# Altium project Cell Characterization Board V2.PrjPcb
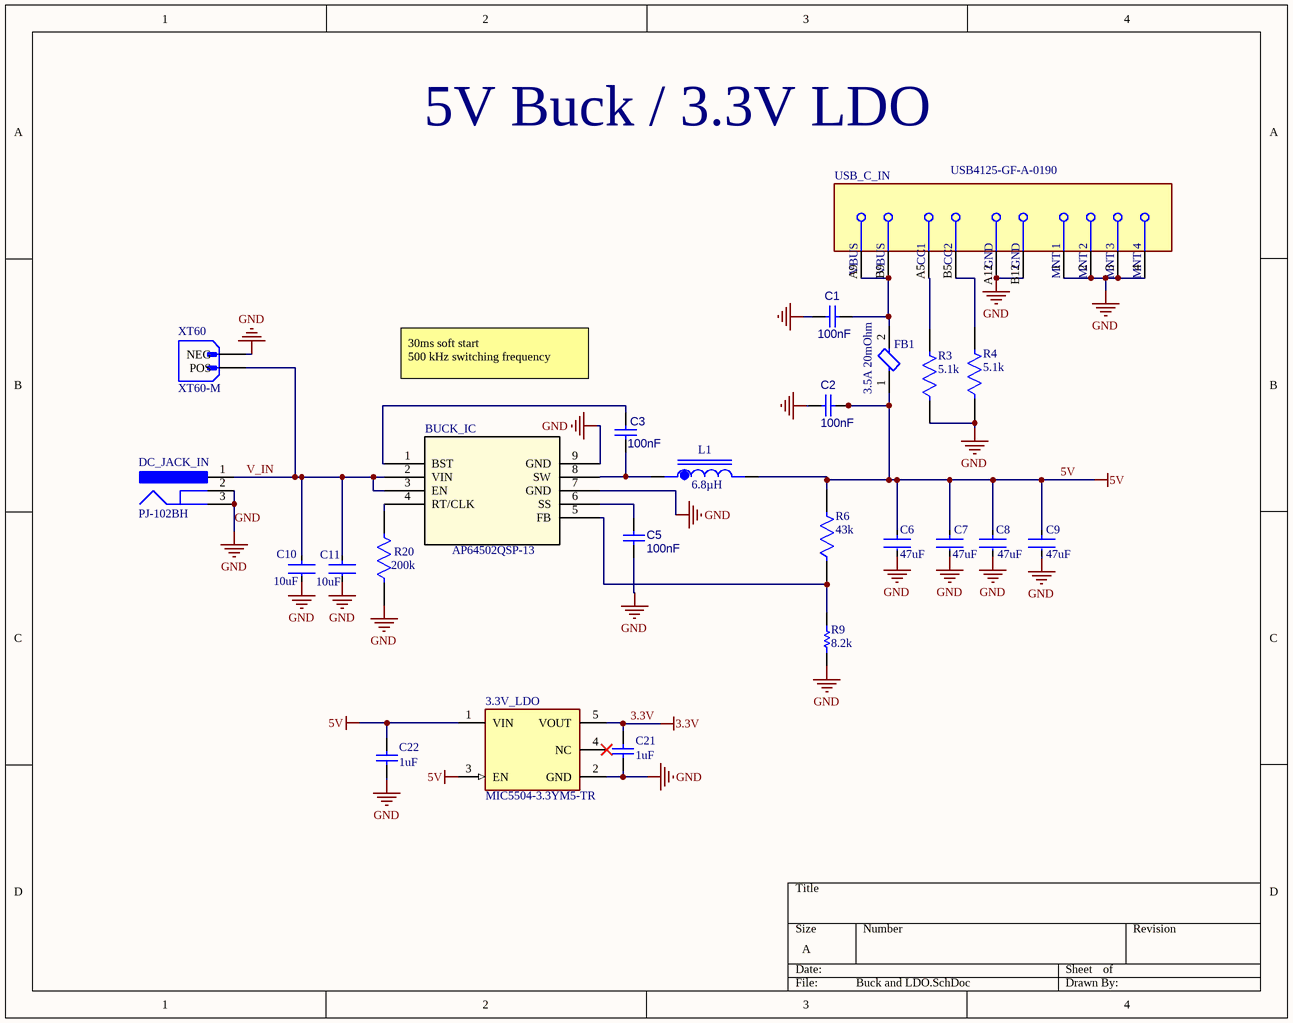
[diagram p0: Buck and LDO.SchDoc]
CAGE_CODE: ?????; CONTRACT_NUMBER: <CONTRACT NO>; DOC_NO_ASSY_DWG: <ASSY DWG NO>; DOC_NO_BOM: <BOM DOC NO>; DOC_NO_FAB_DWG: <FAB DWG NO>; DOC_NO_SCH_DWG: <SCH DWG NO>; PCB_2_DEC_TOL: +/-.01; PCB_3_DEC_TOL: +/-.010; PCB_ANG_TOL: +/-1/2; PCB_ASSEMBLY_NO: <PCB ASSY NO>; PCB_CHECKER: - -----; PCB_CHECKER_APP_DATE: --/--/----; PCB_DESIGNER: - -----; PCB_DESIGNER_APP_DATE: --/--/----; PCB_DWG_NO: <PCB DWG NO>; PCB_ENGINEER: - -----; PCB_ENGINEER_APP_DATE: --/--/----; PCB_PART_NUMBER: <PCB PN>; PCB_REV: A; SCH_REV: A
6 sheets, 120 parts. Net scope: flat (ports and power ports of the same name join across sheets).
Board file: Cell Characterization Board V2.PcbDoc
Sheets:
  Buck and LDO.SchDoc
  Constant Current Sink.SchDoc
  Sequantial Cell Switching.SchDoc
  MCU.SchDoc
  MicroSD.SchDoc
  Cell Monitoring.SchDoc

## Sheet Buck and LDO.SchDoc
size A; SheetNumber: 2; SheetTotal: 8

### Parts
3.3V_LDO  MIC5504-3.3YM5-TR  [FP-SOT23-5LD-PL-1-MFG]
BUCK_IC  AP64502QSP-13  [SO-8EP_DIO]
C1  100nF  [CAPC2013X95X50LL10T25]
C2  100nF  [CAPC2013X95X50LL10T25]
C3  100nF  [CAPC2013X95X50LL10T25]
C5  100nF  [CAPC2013X95X50LL10T25]
C6  47uF  [FP-GRM31C-0_2-e0_3_0_8-IPC_C]
C7  47uF  [FP-GRM31C-0_2-e0_3_0_8-IPC_C]
C8  47uF  [FP-GRM31C-0_2-e0_3_0_8-IPC_C]
C9  47uF  [FP-GRM31C-0_2-e0_3_0_8-IPC_C]
C10  10uF  [FP-CL31-IPC_C]
C11  10uF  [FP-CL31-IPC_C]
C21  1uF  [CAPC3216X180X50ML20T25]
C22  1uF  [CAPC3216X180X50ML20T25]
DC_JACK_IN  PJ-102BH  [CUI-PJ-102BH_V]
FB1  3.5A 20mOhm  [FP-BLM31-0_2-t1_1-MFG]
L1  value 6.8µH  [IND_MGAH06036R8M-10]  (hidden comment: MGAH06036R8M-10)
R3  5.1k  [FP-MCT0603-IPC_B]
R4  5.1k  [FP-MCT0603-IPC_B]
R6  43k  [FP-MCU0805-IPC_C]
R9  8.2k  [RESC0805(2012)_N]
R20  200k  [FP-CRCW0603-HPe3-MFG]
USB_C_IN  USB4125-GF-A-0190  [FP-USB4125-GF-A-0190-MFG]
XT60  XT60-M  [AMASS_XT60-M]

### Nets
3.3V: 3.3V_LDO.5(VOUT) C21.2
5V: 3.3V_LDO.1(VIN) 3.3V_LDO.3(EN) C2.2 C6.1 C7.1 C8.1 C9.1 C22.2 FB1.1 L1.2 R6.2
GND: 3.3V_LDO.2(GND) BUCK_IC.7(GND) BUCK_IC.9(GND) C1.1 C2.1 C5.1 C6.2 C7.2 C8.2 C9.2 C10.2 C11.2 C21.1 C22.1 DC_JACK_IN.2 DC_JACK_IN.3 R3.1 R4.1 R9.1 R20.1 USB_C_IN.1(MNT_1) USB_C_IN.2(MNT_2) USB_C_IN.3(MNT_3) USB_C_IN.4(MNT_4) USB_C_IN.A12(GND) USB_C_IN.B12(GND) XT60.N(NEG)
V_IN: BUCK_IC.2(VIN) BUCK_IC.3(EN) C10.1 C11.1 DC_JACK_IN.1 XT60.P(POS)
NetBUCK_IC_1: BUCK_IC.1(BST) C3.2
NetBUCK_IC_4: BUCK_IC.4(RT/CLK) R20.2
NetBUCK_IC_5: BUCK_IC.5(FB) R6.1 R9.2
NetBUCK_IC_6: BUCK_IC.6(SS) C5.2
NetBUCK_IC_8: BUCK_IC.8(SW) C3.1 L1.1
NetC1_2: C1.2 FB1.2 USB_C_IN.A9(VBUS) USB_C_IN.B9(VBUS)
NetR3_2: R3.2 USB_C_IN.A5(CC1)
NetR4_2: R4.2 USB_C_IN.B5(CC2)

Not connected (* = marked no-connect by the designer): 3.3V_LDO 4(NC)*

### Notes on the sheet
- 5V Buck / 3.3V LDO
- 30ms soft start
  500 kHz switching frequency

### Library data of the parts
3.3V_LDO = CMP-2000-07604-2: IC REG LINEAR 3.3V 300MA SOT23-5; Quiescent Current: 38uA; Operating Supply Current: 42uA; Max Input Voltage: 5.5V; Min Input Voltage: 2.5V; Output Type: Fixed; Power Supply Rejection Ratio (PSRR): 60dB; Dropout Voltage: 380mV; Accuracy: 3%; Number of Outputs: 1; Nominal Output Voltage: 3.3V; Max Output Current: 300mA; Length: 2.9mm; Mount: Surface Mount; Width: 1.6mm; Packaging: Tape and Reel; Output Current: 300mA; Min Operating Temperature: -40°C; Max Operating Temperature: 125°C; Height: 1.1mm; Case/Package: SOT-23-5; REACH SVHC: No SVHC; Number of Pins: 5; Output Voltage: 3.3V
BUCK_IC = AP64502QSP-13: Description; Manufacturer_Name: Diodes Inc; Copyright: Copyright (C) 2025 Ultra Librarian. All rights reserved.; Manufacturer_Part_Number: AP64502QSP-13; RefDes: RefDes; Type: Type; Supplier 1: Avnet; Supplier Part Number 1: AP64502QSP-13
C1-C3 C5 = CMP-001-00018-6: Capacitor 100 nF +/-10% 50 V 0805; Voltage Rating: 50V; Tolerance: 10%; Capacitor Type: Ceramic; Value: 100nF; Pins: 2; Max Operating Temperature: 125°C; Min Operating Temperature: -55°C; Mounting Technology: SM; Case/Package: 0805; RoHS Compliant: True
C6-C9 = CMP-2000-05255-3: Chip Multilayer Ceramic Capacitors for General Purpose, 1206, 47uF, X5R, 15%, 20%, 10V; Case/Package: 1206; Radiation Hardening: No; Case Code (Metric): 3216; Max Operating Temperature: 85°C; Capacitance: 47uF; Tolerance: 20%; REACH SVHC: No SVHC; Depth: 1.6mm; Case Code (Imperial): 1206; Termination: SMD/SMT; Voltage Rating (DC): 10V; Package Quantity: 2000; Voltage Rating: 10V; Width: 1.6mm; Lead Free: Lead Free; Voltage: 10V; Packaging: Tape and Reel; Length: 3.2mm; Height: 1.6mm; Number of Pins: 2; Thickness: 0.071inch; Min Operating Temperature: -55°C; Dielectric: X5R; Mount: Surface Mount
C10 C11 = CMP-13271-000016-1: CAP CER 10UF 50V X5R 1206; Manufacturer: Samsung; Manufacturer Part Number: CL31A106KBHNNNE; Tolerance: 10%; Material: Ceramic; Temperature Coefficient: 15%; RoHS: TRUE; Ipc Land Pattern Name: CAPC320160X160; Temperature Range Low: -55°C; Value: 10uF; Device Class L3: Ceramic Capacitors; Category: Cap; Temperature Characteristic: X5R; Lead Free: Yes; Device Class L2: Capacitors; Octopart: https://octopart.com/cl31a106kbhnnne-samsung-19832778; ComponentLink2Description: Datasheet; Digikey Description: CAP CER 10UF 50V X5R 1206; Voltage: 50V; ComponentLink2URL: http://www.samsungsem.com/kr/support/product-search/mlcc/__icsFiles/afieldfile/2018/06/21/CL31A106KBHNNNE.pdf; Capacitance: 10uF; Temperature Range High: +85°C; Device Class L1: Passive Components; Height: 1.8mm; Automotive: No; Voltage Rating: 50V; Package: CL31; Temperature: -55°C to +85°C
C21 C22 = CMP-2000-04991-1: Chip Capacitor, 1 uF, +/- 10%, 25 V, -55 to 125 degC, 1206 (3216 Metric), RoHS, Tape and Reel; Manufacturer: Kemet; Temperature Coefficient / Code: +/-15%; Dielectric: X7R; Voltage Rating DC: 25V; Capacitance - nF: 1000nF; Class: Class1; Case Length: 3.2mm; Type: SMDMLCCX7R6.3-250VDCCommericalGrade; Case Width: 1.6mm; Product: GeneralTypeMLCCs; Capacitance: 1uF; Datasheet URL: https://ciiva.com/datasheet-click-18194173?src=ciiva&sig=6daff8c4; Operating Temperature Range: -55Cto+125C; Series: C1206C; RoHS: Details; Product Category: MultilayerCeramicCapacitorsMLCC-SMD/SMT; Manufacturer URL: http://www.kemet.com/; Minimum Operating Temperature: -55C; Dimensions: 1.6mmWx3.2mmLx1.6mmH; Termination Style: SMD/SMT; Brand: Kemet; Packaging: Reel; Package / Case: 1206(3216metric); Case Code - mm: 3216; Datasheet Version: Jul-14; Factory Pack Quantity: 2000; Package Description: 2-Pin Surface Mount Device, Body 3.2 x 1.6 mm; Tolerance: 10%; Package Reference: 1206; Case Height: 1.6mm; Case Code - in: 1206; Maximum Operating Temperature: +125C; Voltage Rating: 25V
DC_JACK_IN = CMP-2000-06901-1: Through Hole Right Angle DC Power Jack, 5 A, 2.5 mm Center Pin, 3 Position, -25 to 85 degC, RoHS, Bulk; Manufacturer: CUIInc.; Outside Contact Diameter: 6.5mm; Current Rating: 5A; Brand: CUI; Insulation Resistance: 100MOhms; Inside Contact Diameter: 2.5mm; Voltage Rating: 24V; Operating Temperature Range: -25Cto+85C; Mounting Angle: Right; Mounting Technology: ThroughHole; Product Category: DCPowerConnectors; Datasheet Version: Rev. 1.02, 05/2016; Connector Type: DCPowerJack; Contact Material: Copper; Housing Material: PolybutyleneTerephthalate(PBT); Mounting Style: ThroughHole; Product: Jacks; Package Reference: PJ-102BH; Manufacturer URL: http://www.cui.com/; RoHS: True; Contact Gender: Male; Contact Plating: Nickel; Flammability Rating: UL94V-0; Factory Pack Quantity: 280; Datasheet URL: http://www.cui.com/product/resource/pj-102bh.pdf; Package Description: 3-Pin Through Hole Device, Body 14.4 x 9 mm, Height 11 mm; Termination Style: ThroughHole
FB1 = CMP-0686-00732-3: BLM31PG121SN1L Chip Ferrite Bead Array, 1206, 120Ω @ 100MHz, 0.02Ω, 25%, 3.5A; Number of Lines: 1; DC Current: 3A; Impedance: 120R; Material: Steel; DC Resistance (DCR): 20mR; Shielding: Unshielded; Number of Pins: 2; Case Code (Metric): 3216; Contact Plating: Tin; Radiation Hardening: No; Termination: SMD/SMT; Lead Free: Lead Free; Core Material: Ferrite; Case Code (Imperial): 1206; Test Frequency: 100MHz; Depth: 1.6mm; Max Operating Temperature: 125°C; Package Quantity: 3000; Packaging: Tape and Reel; Min Operating Temperature: -55°C; Length: 3.2mm; Current Rating: 3.5A; RoHS Compliant: Yes; Tolerance: 25%; Width: 1.6mm; Max Current Rating: 3.5A; Frequency: 100MHz; Military Standard: Not; Case/Package: 1206; Max DC Current: 3A; Height: 1.1mm
L1 = CMP-006-00023-1: 6.8 ÂµH Shielded Molded Inductor 5 A 50mOhm Max Nonstandard; MF: Laird-Signal Integrity Products; SnapEDA_Link: https://www.snapeda.com/parts/MGAH06036R8M-10/Laird/view-part/?ref=snap; Price: None; Availability: In Stock; Pins: 2; Design Item ID: MGAH06036R8M-10; Check_prices: https://www.snapeda.com/parts/MGAH06036R8M-10/Laird/view-part/?ref=eda; Component Type: Standard; Case/Package: None; Purchase-URL: https://pricing.snapeda.com/search/part/MGAH06036R8M-10/?ref=eda; MP: MGAH06036R8M-10; Source: MGAH06036R8M-10.SchLib
R3 R4 = CMP-02407-010205-1: MCT06030D5101BP500 RES SMD 5100 OHM 1% 1/8W 0603; Resistance: 5.1kR; Tolerance: 0.1%; Temperature Coefficient: 25ppm/°C; Max Operating Temperature: 125°C; Radiation Hardening: No; Composition: Thin Film; Height: 450um; Lead Free: Lead Free; Contact Plating: Tin; Length: 1.55mm; Width: 850um; Case/Package: 0603; Min Operating Temperature: -55°C
R6 = CMP-02407-010835-1: MCU08050C4302FP500 RES 1.05K OHM 0.5% 1/5W 0805; Tolerance: 1%; Resistance: 43000R; Height: 450um; Lead Free: Lead Free; Length: 2mm; Case/Package: 0805; Width: 1.25mm
R9 = CMP-1013-00613-1: 8K2 0.125W 1% 0805 (2012 Metric)  SMD; Value: 8200.00 Ohm; Case-EIA: 0805; Case-Metric: 2012; Power: 0.125 W; Tolerance: 1 %; Technology: SMT
R20 = CMP-02407-007717-1: RES Thick Film, 200kΩ, 1%, 0.33W, 100ppm/°C, 0603; Resistance: 200kR; Max Power Dissipation: 250mW; Tolerance: 1%; Composition: Thick Film; Features: Automotive AEC-Q200; Min Operating Temperature: -55°C; Case/Package: 0603; Length: 0.063inch; Max Operating Temperature: 155°C; Number of Terminations: 2; Height: 0.022inch; Military Standard: Not; Package Quantity: 5000; Width: 0.033inch; Temperature Coefficient: 100ppm/°C; Lead Free: Lead Free; Packaging: Tape and Reel; Depth: 0.85mm
USB_C_IN = CMP-245163-000004-1: CONN RCPT TYPE C 6P SMD RA
XT60 = CMP-002-00073-1: Plug; DC supply; XT60; male; PIN: 2; for cable; soldered; 30A; 500V; MF: AMASS; Design Item ID: XT60-M; Component Type: Standard; Case/Package: Package; MP: XT60-M; Value: *; Pins: 2; Check_prices: https://www.snapeda.com/parts/XT60-M/AMASS/view-part/?ref=eda; Source: XT60-M.SchLib; SnapEDA_Link: https://www.snapeda.com/parts/XT60-M/AMASS/view-part/?ref=snap

## Sheet Constant Current Sink.SchDoc
size A4; SheetNumber: 3; SheetTotal: 8
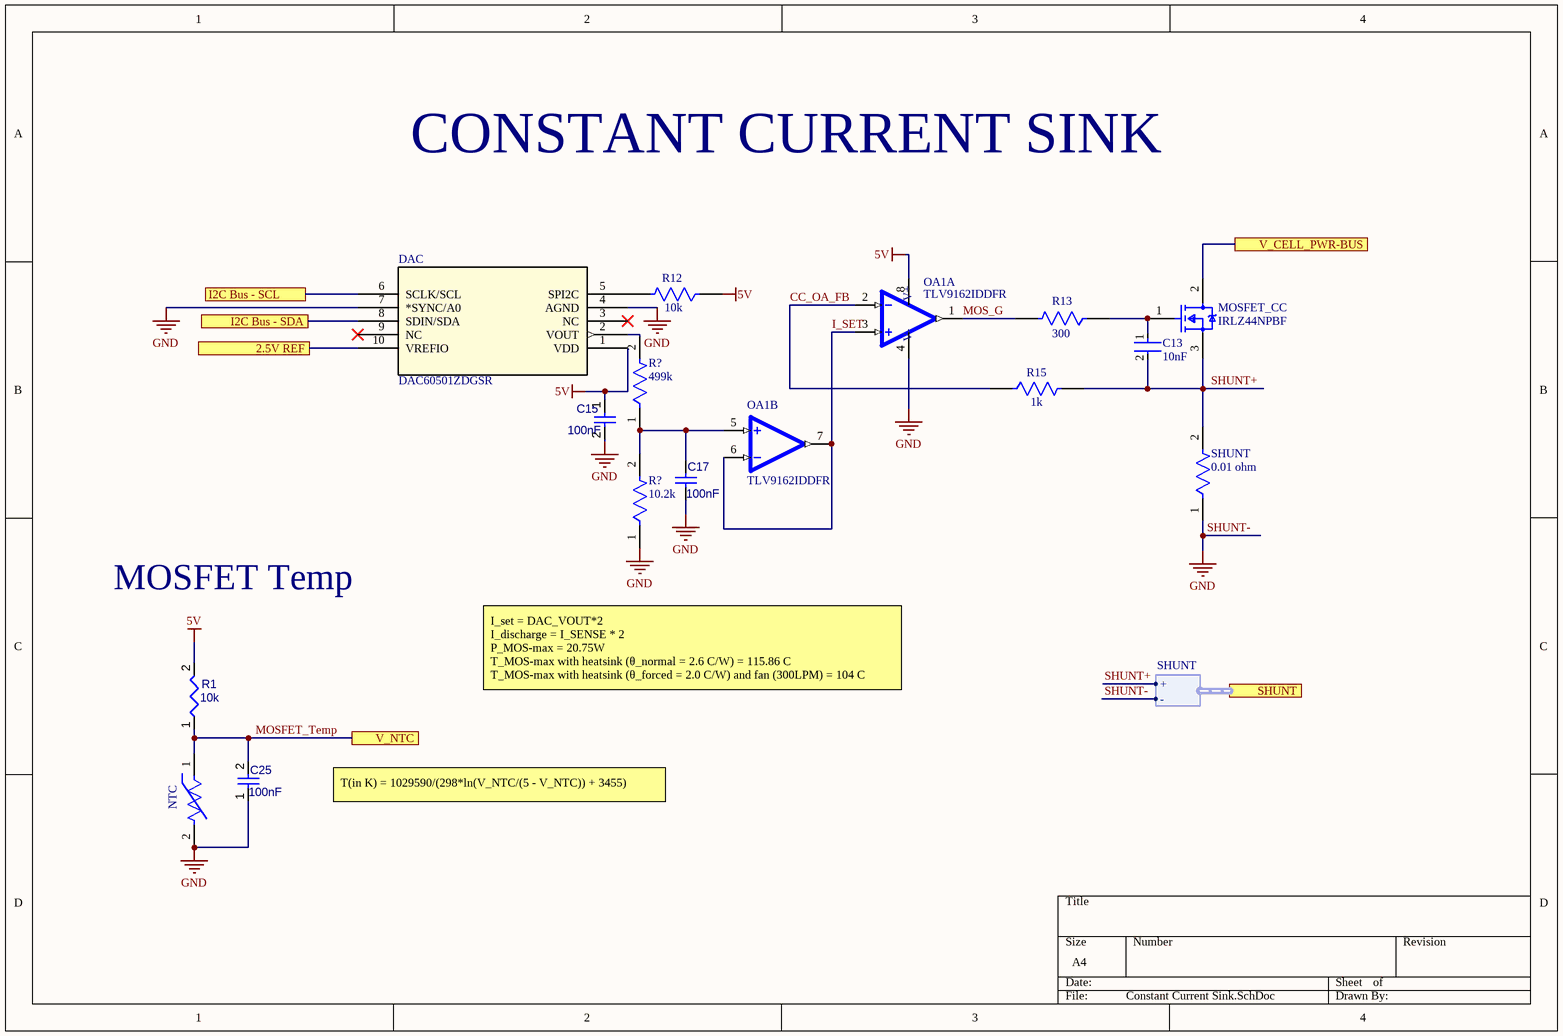
[diagram p1: Constant Current Sink.SchDoc]

### Parts
(Parts that share a designator on the sheet are numbered #1, #2 ... from top to bottom, then left to right.)
C13  10nF  [FP-GCM219-0_15-IPC_C]
C15  100nF  [CAPC2013X95X50LL10T25]
C17  100nF  [CAPC2013X95X50LL10T25]
C25  100nF  [CAPC2013X95X50LL10T25]
DAC  DAC60501ZDGSR  [DGS10_TEX]
MOSFET_CC  IRLZ44NPBF  [FP-PG-TO220-3-MFG]
NTC  NXRT15XH103FA1B030  [FP-NXR_151B030-MFG]  (value not drawn)
OA1  TLV9162IDDFR  [SOT65P280X110-8N]  (parts A,B of 2)
R1  10k  [RESC2013X50X35ML15T15]
R12  10k  [FP-AC0603-IPC_A]
R13  300  [FP-CR0805-MFG]
R15  1k  [FP-RN73R2A-IPC_A]
R?#1  499k  [FP-RQ732B-IPC_C]
R?#2  10.2k  [FP-RT1206-MFG]
SHUNT  0.01 ohm  [FP-PA2512E-R007-0R10-MFG]

### Ports
2.5V REF, I2C Bus - SCL, I2C Bus - SDA, SHUNT (harness SHUNT), V_CELL_PWR-BUS, V_NTC

### Harnesses
SHUNT: +, -

### Nets
5V: C15.1 DAC.1(VDD) OA1.8(V+) R1.2 R12.1
GND: C15.2 C17.2 C25.1 DAC.4(AGND) DAC.7(*SYNC/A0) NTC.2 OA1.4(V-) R?#2.1 SHUNT.1 ; port SHUNT.-  [also labelled SHUNT-]
CC_OA_FB: OA1.2(IN1-) R15.1
I_SET: OA1.3(IN1+) OA1.6(IN2-) OA1.7(OUT2)
MOS_G: OA1.1(OUT1) R13.2
MOSFET_Temp: C25.2 NTC.1 R1.1 ; port V_NTC
SHUNT+: C13.2 MOSFET_CC.3(S) R15.2 SHUNT.2 ; port SHUNT.+
NetC13_1: C13.1 MOSFET_CC.1(G) R13.1
NetC17_1: C17.1 OA1.5(IN2+) R?#1.1 R?#2.2
NetDAC_2: DAC.2(VOUT) R?#1.2
NetDAC_5: DAC.5(SPI2C) R12.2
NetDAC_6: DAC.6(SCLK/SCL) ; port I2C Bus - SCL
NetDAC_8: DAC.8(SDIN/SDA) ; port I2C Bus - SDA
NetDAC_10: DAC.10(VREFIO) ; port 2.5V REF
NetMOSFET_CC_2: MOSFET_CC.2(D) ; port V_CELL_PWR-BUS

Not connected (* = marked no-connect by the designer): DAC 3(NC)* 9(NC)*

### Notes on the sheet
- CONSTANT CURRENT SINK
- MOSFET Temp
- I_set = DAC_VOUT*2
  I_discharge = I_SENSE * 2
  P_MOS-max = 20.75W
  T_MOS-max with heatsink (θ_normal = 2.6 C/W) = 115.86 C
  T_MOS-max with heatsink (θ_forced = 2.0 C/W) and fan (300LPM) = 104 C
- T(in K) = 1029590/(298*ln(V_NTC/(5 - V_NTC)) + 3455)

### Library data of the parts
C13 = CMP-06035-023057-1: Ceramic Capacitor for Automotive 10nF  ±10% 100VDC X8R 0805 Paper T/R
C15 C17 C25 = CMP-001-00018-6: as C1 on sheet Buck and LDO; Value: 100nF; Pins: 2; Max Operating Temperature: 125°C; Min Operating Temperature: -55°C; Mounting Technology: SM; Case/Package: 0805; RoHS Compliant: True
DAC = DAC60501ZDGSR: True 12-bit, 1-ch, SPI/I2C, voltage-output DAC in WSON package with precision internal reference 10-VSSOP -40 to 125; Manufacturer_Name: Texas Instruments; Copyright: Copyright (C) 2025 Ultra Librarian. All rights reserved.; Manufacturer_Part_Number: DAC60501ZDGSR; RefDes: RefDes; Type: Type
MOSFET_CC = CMP-32901-000488-1: MOSFET N-CH 55V 47A TO220AB; Turn-On Delay Time: 11ns; Gate to Source Voltage (Vgs): 16V; Element Configuration: Single; Rds On Max: 22mR; Turn-Off Delay Time: 26ns; Max Power Dissipation: 110W; Threshold Voltage: 2V; Drain to Source Resistance: 35mR; Input Capacitance: 1.7nF; Continuous Drain Current (ID): 47A; Case/Package: TO-220; Lead Free: Lead Free; Halogen Free: Halogen Free; Packaging: Rail/Tube; Length: 0.414inch; Min Operating Temperature: -55°C; REACH SVHC: No SVHC; Number of Pins: 3; Width: 0.185inch; Drain to Source Voltage (Vdss): 55V; Power Dissipation: 110W; RoHS Compliant: Yes; Max Operating Temperature: 175°C; Height: 0.6inch; Max Dual Supply Voltage: 55V; Drain to Source Breakdown Voltage: 55V; Mount: Through Hole
NTC = CMP-06022-001050-1: Thermistor NTC 10kΩ ±1% 2-Pin Radial Bulk; Resistance: 10kR; Max Power Dissipation: 7.5mW; Lead Diameter: 0.4mm; RoHS Compliant: Yes; Number of Pins: 2; Lead Free: Lead Free; Height: 2mm; Lead Pitch: 2.5mm; Power Rating: 7.5mW; Series: NXR; Packaging: Bulk; Package Quantity: 500; Width: 4mm; Max Operating Temperature: 125°C; Termination: Radial; Min Operating Temperature: -40°C; Tolerance: 1%; Resistance Tolerance: 1%; Length: 5mm; Mount: Through Hole
OA1 = CMP-014-00004-1: Dual, 16V, 11MHz, rail-to-rail input and output low-offset-voltage low-noise operational amplifier; MF: Texas Instruments; SnapEDA_Link: https://www.snapeda.com/parts/TLV9162IDDFR/Texas+Instruments/view-part/?ref=snap; Case/Package: SOT-23-THN-8 Texas Instruments; Component Type: Standard; Design Item ID: TLV9162IDDFR; MP: TLV9162IDDFR; Pins: 8; Source: TLV9162IDDFR.SchLib; Check_prices: https://www.snapeda.com/parts/TLV9162IDDFR/Texas+Instruments/view-part/?ref=eda; Value: *
R1 = CMP-009-00018-5: Chip Resistor, 10 KOhm, +/- 1%, 125 mW, -55 to 155 degC, 0805 (2012 Metric); Power: 125mW; Voltage Rating: 150V; Tolerance: 1%; Pins: 2; Min Operating Temperature: -55°C; Case/Package: 0805; Max Operating Temperature: 155°C; RoHS Compliant: True; Mounting Technology: SM
R12 = CMP-03412-040683-1: RES 10kΩ 5.00% 0.2W 0603
R13 = CMP-07231-003646-1: CR0805-FX-3000ELF Thick Film Chip Resistors 0805 300Ω 0.125W 1% 100ppm/°C; Max Power Dissipation: 125mW; Voltage Rating: 150V; Resistance: 300R; Contact Plating: Tin; Number of Terminations: 2; Termination: SMD/SMT; Case Code (Imperial): 0805; Mount: Surface Mount; Length: 2mm; Thickness: 508um; Package Quantity: 1; Case Code (Metric): 2012; Width: 1.25mm; Military Standard: Not; Max Operating Temperature: 155°C; Temperature Coefficient: 100ppm/°C; Min Operating Temperature: -55°C; Features: Moisture Resistant; Radiation Hardening: No; Composition: Thick Film; Height: 0.024inch; Power Rating: 125mW; Depth: 1.25mm; Tolerance: 1%; Packaging: Tape and Reel; Case/Package: 0805
R15 = CMP-04015-026717-1: RN73R2ATTD1001B10 1kΩ ±0.1% 0.125W, 1/8W Chip Resistor 0805 (2012 Metric) Moisture Resistant Thin Film
R?#1 = CMP-03211-002016-1: RQ732B 1206 499KΩ 0.4W 10ppm/°C 0.1% 200V; Manufacturer: TE; Manufacturer Part Number: RQ73C2B499KBTD; Automotive Grade: Grade 0; Device Class L2: Resistors; Height: 0.75mm; Tolerance: 0.1%; Octopart: https://octopart.com/5-2176392-6-te+connectivity-93905009; ComponentLink2Description: Datasheet; Lead Free: Yes; Temperature Range High: +155°C; RoHS: TRUE; Category: Res; Voltage Rating: 200V; Temperature Coefficient: 10ppm/°C; Package: RQ732B; Power Rating: 0.4W; Device Class L1: Passive Components; Device Class L3: Chip SMD Resistors; ComponentLink2URL: https://www.te.com/commerce/DocumentDelivery/DDEController?Action=showdoc&DocId=Data+Sheet%7F1773270-2%7FA%7Fpdf%7FEnglish%7FENG_DS_1773270-2_A.pdf%7F9-2176388-657; Temperature: -55°C to +155°C; Value: 499KΩ; Ipc Land Pattern Name: RESC310160X60; Resistance: 499KΩ; Composition: Thin Film; Temperature Range Low: -55°C; Series: RQ73; Automotive: Yes
R?#2 = CMP-2003-04153-2: RES SMD 10.2K OHM 1% 1/4W 1206; Manufacturer Part Number: RT1206FRE0710K2L; Manufacturer: Yageo; Resistance: 10.2KΩ; Value: 10.2KΩ; Description: RT1206 10.2KΩ 0.25W 50 ppm/°C 0.02%; Temperature Coefficient: 50 ppm/°C; Power Rating: 0.25W; Voltage Rating: 200V; Tolerance: 0.0002; Automotive: No; Device Class L2: Resistors; Device Class L1: Passive Components; Lead Free: Yes; Series: RT; RoHS: TRUE; Device Class L3: Chip SMD Resistors; Footprint Url: http://www.yageo.com/exep/pages/download/literatures/PYu-R_Mount_10.pdf; Ipc Land Pattern Name: RESC310160X55; Mouser Description: Thin Film Resistors - SMD 1/4W 10.2K ohm 1% 50ppm; Temperature Range High: +155°C; ComponentLink2Description: Datasheet; Height: 0.65mm; Temperature Range Low: -55°C; Octopart: https://octopart.com/rt1206fre0710k2l-yageo-1255827; Category: Res; Package: RT1206; Temperature: -55°C to +155°C; ComponentLink2URL: http://www.yageo.com/documents/recent/PYu-RT_1-to-0.01_RoHS_L_9.pdf; Composition: Thin Film; Digikey Description: RES SMD 10.2K OHM 1% 1/4W 1206
SHUNT = CMP-03412-024797-1: METAL CURRENT SENSOR 2512 1% 50P; Manufacturer: Yageo; Manufacturer Part Number: PA2512FKE7W0R01E; Value: 10mΩ; Temperature Coefficient: 50ppm/°C; Automotive Grade: Grade 0; Description: 10 mOhms ±1% 2W Chip Resistor 2512 (6432 Metric) Automotive AEC-Q200, Current Sense, Moisture Resistant Metal Element; Power Rating: 2W; Automotive: Yes; Series: PA_E; Height: 0.88mm; Category: Res; Temperature Range Low: -55°C; Ipc Land Pattern Name: RESC635318X63; Device Class L3: Chip SMD Resistors; ComponentLink2URL: http://www.yageo.com/documents/recent/PYu-PA_E_51_RoHS_10.pdf; Composition: Metal Element; Device Class L1: Passive Components; ComponentLink2Description: Datasheet; Resistance: 10mΩ; Package: PA2512E-R007-0R10; Digikey Description: METAL CURRENT SENSOR 2512 1% 50P; Temperature Range High: +170°C; Octopart: https://octopart.com/pa2512fke7w0r01e-yageo-85405230; Device Class L2: Resistors; Temperature: -55°C to +170°C; Lead Free: Yes; Tolerance: 1%; RoHS: TRUE

## Sheet Sequantial Cell Switching.SchDoc
size 431 x 279 mm; SheetNumber: 5; SheetTotal: 8
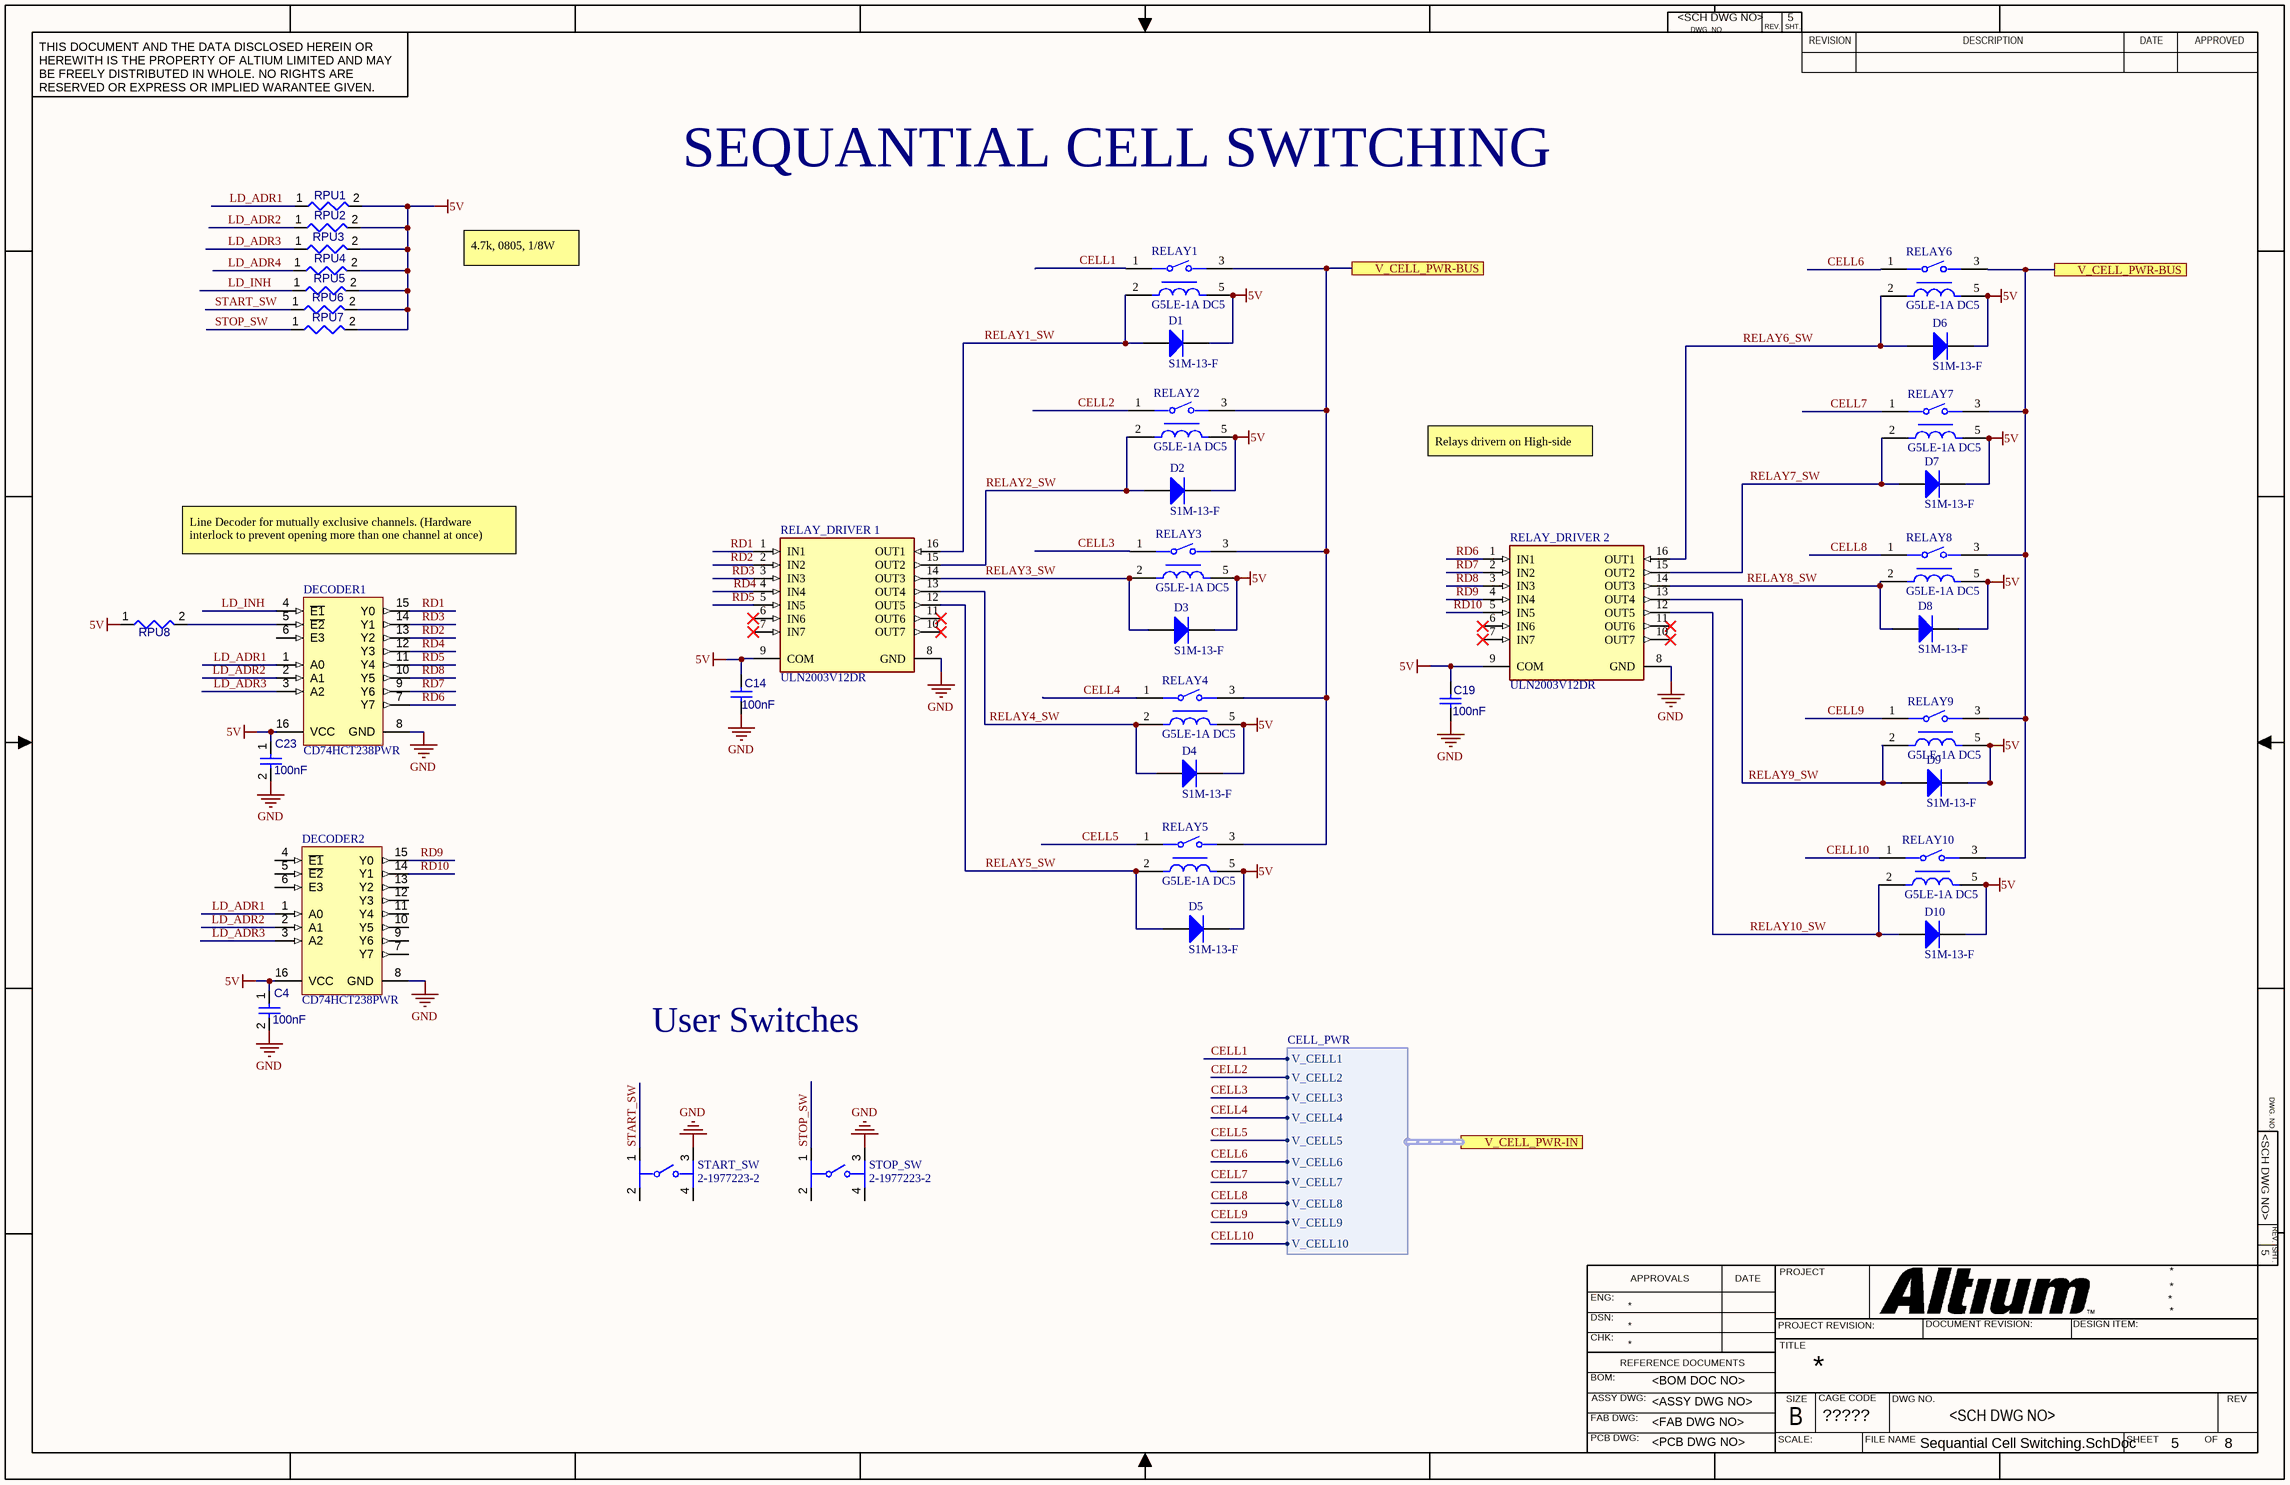
[diagram p2: Sequantial Cell Switching.SchDoc]

### Parts
C4  100nF  [CAPC2013X95X50LL10T25]
C14  100nF  [CAPC2013X95X50LL10T25]
C19  100nF  [CAPC2013X95X50LL10T25]
C23  100nF  [CAPC2013X95X50LL10T25]
D1  S1M-13-F  [DIOD-S1M-13-F-SMA-2_V]
D2  S1M-13-F  [DIOD-S1M-13-F-SMA-2_V]
D3  S1M-13-F  [DIOD-S1M-13-F-SMA-2_V]
D4  S1M-13-F  [DIOD-S1M-13-F-SMA-2_V]
D5  S1M-13-F  [DIOD-S1M-13-F-SMA-2_V]
D6  S1M-13-F  [DIOD-S1M-13-F-SMA-2_V]
D7  S1M-13-F  [DIOD-S1M-13-F-SMA-2_V]
D8  S1M-13-F  [DIOD-S1M-13-F-SMA-2_V]
D9  S1M-13-F  [DIOD-S1M-13-F-SMA-2_V]
D10  S1M-13-F  [DIOD-S1M-13-F-SMA-2_V]
DECODER1  CD74HCT238PWR  [PW0016A_L]
DECODER2  CD74HCT238PWR  [PW0016A_L]
RELAY1  G5LE-1A DC5  [FP-G5LE-1A_DC5-MFG]
RELAY2  G5LE-1A DC5  [FP-G5LE-1A_DC5-MFG]
RELAY3  G5LE-1A DC5  [FP-G5LE-1A_DC5-MFG]
RELAY4  G5LE-1A DC5  [FP-G5LE-1A_DC5-MFG]
RELAY5  G5LE-1A DC5  [FP-G5LE-1A_DC5-MFG]
RELAY6  G5LE-1A DC5  [FP-G5LE-1A_DC5-MFG]
RELAY7  G5LE-1A DC5  [FP-G5LE-1A_DC5-MFG]
RELAY8  G5LE-1A DC5  [FP-G5LE-1A_DC5-MFG]
RELAY9  G5LE-1A DC5  [FP-G5LE-1A_DC5-MFG]
RELAY10  G5LE-1A DC5  [FP-G5LE-1A_DC5-MFG]
RELAY_DRIVER_1  ULN2003V12DR  [FP-D0016A-MFG]
RELAY_DRIVER_2  ULN2003V12DR  [FP-D0016A-MFG]
RPU1  Resistor 4k7 +/-1% 0805 125 mW  [RESC2013X70X40ML20T20]  (value not drawn)
RPU2  Resistor 4k7 +/-1% 0805 125 mW  [RESC2013X70X40ML20T20]  (value not drawn)
RPU3  Resistor 4k7 +/-1% 0805 125 mW  [RESC2013X70X40ML20T20]  (value not drawn)
RPU4  Resistor 4k7 +/-1% 0805 125 mW  [RESC2013X70X40ML20T20]  (value not drawn)
RPU5  Resistor 4k7 +/-1% 0805 125 mW  [RESC2013X70X40ML20T20]  (value not drawn)
RPU6  Resistor 4k7 +/-1% 0805 125 mW  [RESC2013X70X40ML20T20]  (value not drawn)
RPU7  Resistor 4k7 +/-1% 0805 125 mW  [RESC2013X70X40ML20T20]  (value not drawn)
RPU8  Resistor 4k7 +/-1% 0805 125 mW  [RESC2013X70X40ML20T20]  (value not drawn)
START_SW  2-1977223-2  [FP-2-1977223-2-MFG]
STOP_SW  2-1977223-2  [FP-2-1977223-2-MFG]

### Ports
V_CELL_PWR-BUS, V_CELL_PWR-IN (harness CELL_PWR)

### Harnesses
CELL_PWR: V_CELL1, V_CELL2, V_CELL3, V_CELL4, V_CELL5, V_CELL6, V_CELL7, V_CELL8, V_CELL9, V_CELL10

### Nets
5V: C4.1 C14.2 C19.2 C23.1 D1.2(K) D2.2(K) D3.2(K) D4.2(K) D5.2(K) D6.2(K) D7.2(K) D8.2(K) D9.2(K) D10.2(K) DECODER1.16(VCC) DECODER2.16(VCC) RELAY1.5 RELAY2.5 RELAY3.5 RELAY4.5 RELAY5.5 RELAY6.5 RELAY7.5 RELAY8.5 RELAY9.5 RELAY10.5 RELAY_DRIVER_1.9(COM) RELAY_DRIVER_2.9(COM) RPU1.2 RPU2.2 RPU3.2 RPU4.2 RPU5.2 RPU6.2 RPU7.2 RPU8.1
GND: C4.2 C14.1 C19.1 C23.2 DECODER1.8(GND) DECODER2.8(GND) RELAY_DRIVER_1.8(GND) RELAY_DRIVER_2.8(GND) START_SW.3 STOP_SW.3
CELL1: RELAY1.1 ; port V_CELL_PWR-IN.V_CELL1
CELL2: RELAY2.1 ; port V_CELL_PWR-IN.V_CELL2
CELL3: RELAY3.1 ; port V_CELL_PWR-IN.V_CELL3
CELL4: RELAY4.1 ; port V_CELL_PWR-IN.V_CELL4
CELL5: RELAY5.1 ; port V_CELL_PWR-IN.V_CELL5
CELL6: RELAY6.1 ; port V_CELL_PWR-IN.V_CELL6
CELL7: RELAY7.1 ; port V_CELL_PWR-IN.V_CELL7
CELL8: RELAY8.1 ; port V_CELL_PWR-IN.V_CELL8
CELL9: RELAY9.1 ; port V_CELL_PWR-IN.V_CELL9
CELL10: RELAY10.1 ; port V_CELL_PWR-IN.V_CELL10
LD_ADR1: DECODER1.1(A0) DECODER2.1(A0) RPU1.1
LD_ADR2: DECODER1.2(A1) DECODER2.2(A1) RPU2.1
LD_ADR3: DECODER1.3(A2) DECODER2.3(A2) RPU3.1
LD_ADR4: RPU4.1
LD_INH: DECODER1.4(~{E1}) RPU5.1
RD1: DECODER1.15(Y0) RELAY_DRIVER_1.1(IN1)
RD2: DECODER1.13(Y2) RELAY_DRIVER_1.2(IN2)
RD3: DECODER1.14(Y1) RELAY_DRIVER_1.3(IN3)
RD4: DECODER1.12(Y3) RELAY_DRIVER_1.4(IN4)
RD5: DECODER1.11(Y4) RELAY_DRIVER_1.5(IN5)
RD6: DECODER1.7(Y7) RELAY_DRIVER_2.1(IN1)
RD7: DECODER1.9(Y6) RELAY_DRIVER_2.2(IN2)
RD8: DECODER1.10(Y5) RELAY_DRIVER_2.3(IN3)
RD9: DECODER2.15(Y0) RELAY_DRIVER_2.4(IN4)
RD10: DECODER2.14(Y1) RELAY_DRIVER_2.5(IN5)
RELAY1_SW: D1.1(A) RELAY1.2 RELAY_DRIVER_1.16(OUT1)
RELAY2_SW: D2.1(A) RELAY2.2 RELAY_DRIVER_1.15(OUT2)
RELAY3_SW: D3.1(A) RELAY3.2 RELAY_DRIVER_1.14(OUT3)
RELAY4_SW: D4.1(A) RELAY4.2 RELAY_DRIVER_1.13(OUT4)
RELAY5_SW: D5.1(A) RELAY5.2 RELAY_DRIVER_1.12(OUT5)
RELAY6_SW: D6.1(A) RELAY6.2 RELAY_DRIVER_2.16(OUT1)
RELAY7_SW: D7.1(A) RELAY7.2 RELAY_DRIVER_2.15(OUT2)
RELAY8_SW: D8.1(A) RELAY8.2 RELAY_DRIVER_2.14(OUT3)
RELAY9_SW: D9.1(A) RELAY9.2 RELAY_DRIVER_2.13(OUT4)
RELAY10_SW: D10.1(A) RELAY10.2 RELAY_DRIVER_2.12(OUT5)
START_SW: RPU6.1 START_SW.1
STOP_SW: RPU7.1 STOP_SW.1
NetDECODER1_5: DECODER1.5(~{E2}) RPU8.2
NetMOSFET_CC_2: RELAY1.3 RELAY2.3 RELAY3.3 RELAY4.3 RELAY5.3 RELAY6.3 RELAY7.3 RELAY8.3 RELAY9.3 RELAY10.3 ; port V_CELL_PWR-BUS

Not connected (* = marked no-connect by the designer): DECODER1 6(E3); DECODER2 4(~{E1}) 5(~{E2}) 6(E3) 7(Y7) 9(Y6) 10(Y5) 11(Y4) 12(Y3) 13(Y2); RELAY_DRIVER_1 6(IN6)* 7(IN7)* 10(OUT7)* 11(OUT6)*; RELAY_DRIVER_2 6(IN6)* 7(IN7)* 10(OUT7)* 11(OUT6)*; START_SW 2 4; STOP_SW 2 4

### Notes on the sheet
- SEQUANTIAL CELL SWITCHING
- 4.7k, 0805, 1/8W
- Relays drivern on High-side
- Line Decoder for mutually exclusive channels. (Hardware interlock to prevent opening more than one channel at once)
- User Switches
- DWG. NO.
- REV.
- SHT.
- THIS DOCUMENT AND THE DATA DISCLOSED HEREIN OR HEREWITH IS THE PROPERTY OF ALTIUM LIMITED AND MAY BE FREELY DISTRIBUTED IN WHOLE. NO RIGHTS ARE RESERVED OR EXPRESS OR IMPLIED WARANTEE GIVEN.
- REVISION
- DESCRIPTION
- DATE
- APPROVED
- ENG:
- APPROVALS
- PROJECT
- DSN:
- CHK:
- REFERENCE DOCUMENTS
- PROJECT REVISION:
- TITLE
- DOCUMENT REVISION:
- DESIGN ITEM:
- BOM:
- FAB DWG:
- PCB DWG:
- ASSY DWG:
- SCALE:
- SIZE
- B
- CAGE CODE
- FILE NAME
- DWG NO.
- SHEET
- OF
- REV

### Library data of the parts
C4 C14 C19 C23 = CMP-001-00018-6: as C1 on sheet Buck and LDO; Value: 100nF; Pins: 2; Max Operating Temperature: 125°C; Min Operating Temperature: -55°C; Mounting Technology: SM; Case/Package: 0805; RoHS Compliant: True
D1-D10 = CMP-0639-00001-1: Surface Mount Glass Passivated Rectifier, 1000V, 1 A, -65 to 125 degC, 2-Pin SMA Package, RoHS, Tape and Reel; Manufacturer: Diodes Inc; Maximum Reverse Current IR (uA): 5; Maximum Peak Forward Surge Current IFSM (A): 30; Maximum Average Rectified Current IO (A): 1; Peak Repetitive Reverse Voltage VRRM (V): 1000; Total Capacitance CT (pF): 10; Forward Voltage Drop VF (V): 1.1; ComponentLink1URL: http://www.diodes.com/; Operating Temperature Range: -65 to 150 degC; ComponentLink3URL: http://diodes.com/datasheets/ds16003.pdf; ComponentLink3Description: Package Specification; PackageDescription: 2-Pin SMD, Body 4.3 x 2.605 mm, Height 2.3 mm; Mounting Technology: Surface Mount; ComponentLink1Description: Manufacturer URL; PackageReference: S1M-13-F-SMA-2; ComponentLink2URL: http://diodes.com/datasheets/ds16003.pdf; ComponentLink2Description: Datasheet; RoHS: TRUE; DatasheetVersion: Rev. 22 - 2; Packing: Tape and Reel; PackageVersion: Rev. 22 - 2; PartNumber: S1M-13-F
DECODER1 DECODER2 = CMP-1633-00901-2: High Speed CMOS Logic 3-to-8 Line Decoder Demultiplexer Inverting and Non-Inverting, PW0016A, LARGE T&R; Manufacturer: Texas Instruments; Input Type: TTL; Technology Family: HCT; VCC(Max)(V): 5.5; VCC(Min)(V): 4.5; ICC @ Nom Voltage(Max)(mA): 0.08; F @ Nom Voltage(Max)(Mhz): 25; Voltage(Nom)(V): 5; Schmitt Trigger: No; Bits(#): 8; Function: Decoder/Demultiplexer; Rating: Catalog; tpd @ Nom Voltage(Max)(ns): 35; Configuration: 3：8; Output Drive (IOL/IOH)(Max)(mA): 4/-4; Channels(#): 1; PackageReference: PW0016A; Type: Standard; Code_JEDEC: MO-153; DatasheetVersion: SCHS147I; Operating Temperature Range(C): -55 to 125; Output Type: CMOS; Generic Part Number: CD74HCT238
RELAY1-RELAY10 = CMP-08822-000152-1: RELAY GEN PURPOSE SPST 10A 5V; Coil Resistance: 63R; Power Rating: 400mW; Max Voltage Rating (AC): 250V; Release Time: 5ms; Max Voltage Rating (DC): 125V; Coil Current: 79.4mA; Coil Type: Non-Latching; Operate Time: 10ms; Relay Type: General Purpose; Coil Voltage (DC): 5V; RoHS Compliant: Yes; Power Consumption: 400mW; Package Quantity: 500; Max Operating Temperature: 85°C; Termination: Solder; Length: 22.5mm; Packaging: Tray; Number of Pins: 4; Max Current Rating: 10A; Mount: Through Hole; Height: 19mm; Throw Configuration: SPST; Min Operating Temperature: -40°C; Coil Power: 400mW; Contact Material: Tin; Contact Current Rating: 10A; Weight: 12g; Lead Free: Lead Free; Width: 16.5mm
RELAY_DRIVER_1 RELAY_DRIVER_2 = CMP-04912-000075-1: MOSFET 7CH 16SOIC; Power Dissipation: 860mW; Output Current: 140mA; Collector Emitter Voltage (VCEO): 20V; Collector Emitter Saturation Voltage: 750mV; Output Voltage: 16V; Number of Drivers: 7; Number of Pins: 16; RoHS Compliant: Yes; Height: 1.5mm; Package Quantity: 1; REACH SVHC: No SVHC; Series: -; Min Operating Temperature: -40°C; Max Power Dissipation: 860mW; Max Collector Current: 140mA; Mount: Surface Mount; Packaging: Tape and Reel; Radiation Hardening: No; Case/Package: SOIC; Max Operating Temperature: 85°C; Number of Outputs: 7; Lead Free: Lead Free; Width: 4mm; Weight: 0.004998oz; Length: 10mm
RPU1-RPU8 = CMP-009-00032-5: Chip Resistor, 4.7 KOhm, +/- 1%, 0.125 W, -55 to 155 degC, 0805 (2012 Metric); Value: 4.7k; Voltage Rating: 150V; Power: 125mW; Tolerance: 1%; Mounting Technology: SM; RoHS Compliant: True; Min Operating Temperature: -55°C; Max Operating Temperature: 155°C; Case/Package: 0805; Pins: 2
START_SW STOP_SW = CMP-03407-000026-1: SWITCH TACTILE SPST-NO 0.05A 24V; RoHS Compliant: Yes

## Sheet MCU.SchDoc
size A4; SheetNumber: 6; SheetTotal: 8
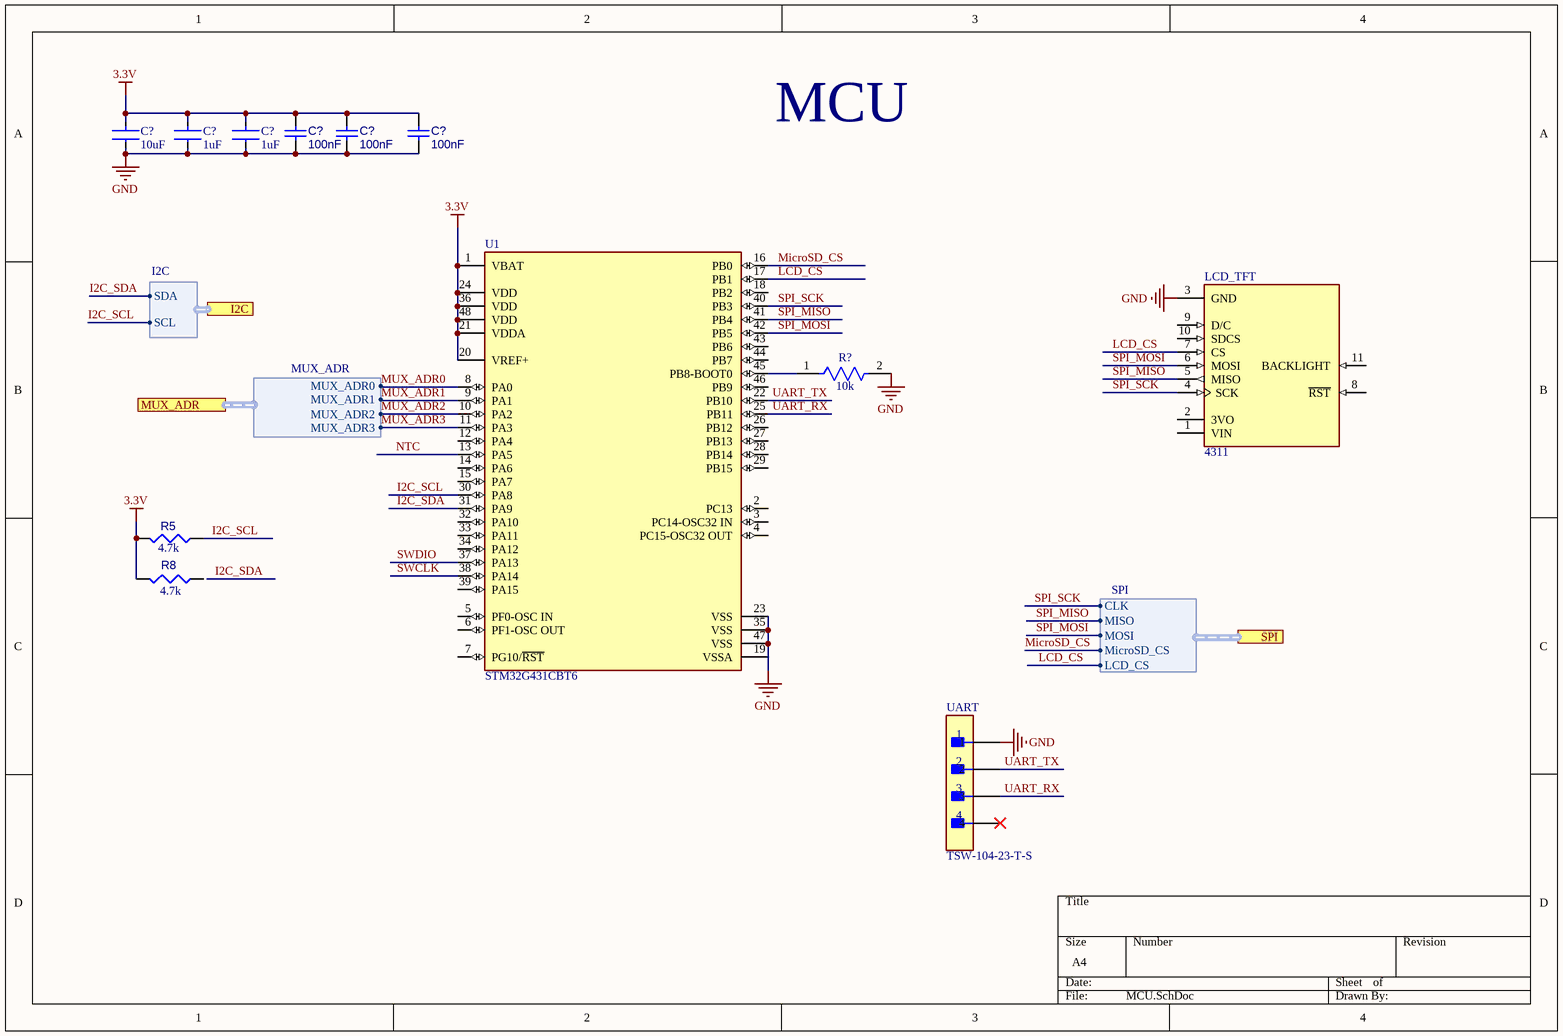
[diagram p3: MCU.SchDoc]

### Parts
(Parts that share a designator on the sheet are numbered #1, #2 ... from top to bottom, then left to right.)
C?#1  10uF  [FP-GCM32E-0_3-IPC_B]
C?#2  1uF  [FP-1206-L_3_2_0_15-W_1_6-IPC_C]
C?#3  1uF  [FP-1206-L_3_2_0_15-W_1_6-IPC_C]
C?#4  100nF  [CAPC2013X95X50LL10T25]
C?#5  100nF  [CAPC2013X95X50LL10T25]
C?#6  100nF  [CAPC2013X95X50LL10T25]
LCD_TFT  4311  [MODULE_4311]
R5  value 4.7k  [RESC2013X70X40ML20T20]  (hidden comment: Resistor 4k7 +/-1% 0805 125 mW)
R8  value 4.7k  [RESC2013X70X40ML20T20]  (hidden comment: Resistor 4k7 +/-1% 0805 125 mW)
R?#3  10k  [FP-AC0603-IPC_A]
U1  STM32G431CBT6  [FP-LQFP48-5B-MFG]
UART  TSW-104-23-T-S  [FP-TSW-104-23-T-S-MFG]

### Ports
I2C (harness I2C), MUX_ADR (harness MUX_ADR), SPI (harness SPI)

### Harnesses
MUX_ADR: MUX_ADR0, MUX_ADR1, MUX_ADR2, MUX_ADR3
I2C: SDA, SCL
SPI: MISO, MOSI, CLK, MicroSD_CS, LCD_CS

### Nets
3.3V: C?#1.2 C?#2.1 C?#3.1 C?#4.2 C?#5.2 C?#6.2 R5.2 R8.2 U1.1(VBAT) U1.20(VREF+) U1.21(VDDA) U1.24(VDD) U1.36(VDD) U1.48(VDD)
GND: C?#1.1 C?#2.2 C?#3.2 C?#4.1 C?#5.1 C?#6.1 LCD_TFT.3(GND) R?#3.2 U1.19(VSSA) U1.23(VSS) U1.35(VSS) U1.47(VSS) UART.1
I2C_SCL: R5.1 U1.30(PA8) ; port I2C.SCL
I2C_SDA: U1.31(PA9) ; port I2C.SDA
LCD_CS: LCD_TFT.7(CS) U1.17(PB1) ; port SPI.LCD_CS
MicroSD_CS: U1.16(PB0) ; port SPI.MicroSD_CS
MUX_ADR0: U1.8(PA0) ; port MUX_ADR.MUX_ADR0
MUX_ADR1: U1.9(PA1) ; port MUX_ADR.MUX_ADR1
MUX_ADR2: U1.10(PA2) ; port MUX_ADR.MUX_ADR2
MUX_ADR3: U1.11(PA3) ; port MUX_ADR.MUX_ADR3
NTC: U1.13(PA5)
SPI_MISO: LCD_TFT.5(MISO) U1.41(PB4) ; port SPI.MISO
SPI_MOSI: LCD_TFT.6(MOSI) U1.42(PB5) ; port SPI.MOSI
SPI_SCK: LCD_TFT.4(SCK) U1.40(PB3)
SWCLK: U1.38(PA14)
SWDIO: U1.37(PA13)
UART_RX: U1.25(PB11) UART.3
UART_TX: U1.22(PB10) UART.2
NetR?#3_1: R?#3.1 U1.45(PB8-BOOT0)

Not connected (* = marked no-connect by the designer): LCD_TFT 1(VIN) 2(3VO) 8(~{RST}) 9(D/C) 10(SDCS) 11(BACKLIGHT); R8 1; U1 2(PC13) 3(PC14-OSC32_IN) 4(PC15-OSC32_OUT) 5(PF0-OSC_IN) 6(PF1-OSC_OUT) 7(PG10/~{RST}) 12(PA4) 14(PA6) 15(PA7) 18(PB2) 26(PB12) 27(PB13) 28(PB14) 29(PB15) 32(PA10) 33(PA11) 34(PA12) 39(PA15) 43(PB6) 44(PB7) 46(PB9); UART 4*

### Notes on the sheet
- MCU

### Library data of the parts
C?#1 = CMP-2000-06321-2: Ceramic Capacitor for Automotive 10uF ±10% 25VDC X7R 1210 Embossed T/R; Voltage: 25V; Thickness: 0.106inch; Min Operating Temperature: -55°C; Max Operating Temperature: 125°C; Ratings: AEC-Q200; Packaging: Tape and Reel; Package Quantity: 1; Width: 2.5mm; Mount: Surface Mount; Height: 2.5mm; Case Code (Imperial): 1210; Length: 3.2mm; Capacitance: 10uF; Tolerance: 10%; Lead Free: Lead Free; Dielectric: X7R; REACH SVHC: No SVHC; Case/Package: 1210; Voltage Rating: 25V; Depth: 2.5mm; Case Code (Metric): 3225; Termination: SMD/SMT; Voltage Rating (DC): 25V; Radiation Hardening: No
C?#2 C?#3 = CMP-14477-000720-2: None; Dielectric: X5R; Voltage Rating (DC): 50V; Tolerance: 10%; Mount: Surface Mount; Min Operating Temperature: -55°C; Width: 1.6mm; Package Quantity: 1; Case Code (Imperial): 1206; Case Code (Metric): 3216; Termination: SMD/SMT; Packaging: Tape and Reel; Height: 0.85mm; Voltage Rating: 50V; Thickness: 0.037inch; Capacitance: 1uF; Series: M; Number of Pins: 2; Max Operating Temperature: 85°C; Length: 0.126inch; RoHS Compliant: Yes; Case/Package: 1206; Halogen Free: Halogen Free
C?#4-C?#6 = CMP-001-00018-6: as C1 on sheet Buck and LDO; Value: 100nF; Pins: 2; Max Operating Temperature: 125°C; Min Operating Temperature: -55°C; Mounting Technology: SM; Case/Package: 0805; RoHS Compliant: True
LCD_TFT = CMP-007-00036-1: Graphic LCD Display Module Red, Green, Blue (RGB) TFT - Color, IPS (In-Plane Switching) SPI 2 (50.80mm) 320 x 240; MF: Adafruit Industries LLC; Check_prices: https://www.snapeda.com/parts/4311/Adafruit+Industries/view-part/?ref=eda; Value: *; Case/Package: None; Design Item ID: 4311; Component Type: Standard; MP: 4311; SnapEDA_Link: https://www.snapeda.com/parts/4311/Adafruit+Industries/view-part/?ref=snap; Pins: 11; Source: 4311.SchLib
R5 R8 = CMP-009-00032-5: Chip Resistor, 4.7 KOhm, +/- 1%, 0.125 W, -55 to 155 degC, 0805 (2012 Metric); Power: 125mW; Voltage Rating: 150V; Mounting Technology: SM; RoHS Compliant: True; Tolerance: 1%; Min Operating Temperature: -55°C; Max Operating Temperature: 155°C; Case/Package: 0805; Pins: 2
R?#3 = CMP-03412-040683-1: RES 10kΩ 5.00% 0.2W 0603
U1 = CMP-12105-000030-1: MAINSTREAM ARM CORTEX-M4+ MCU 17; Manufacturer: STMicroelectronics; Number Of Adc Channels: 17; Number Of I/Os: 38; Standoff Height: 0.05mm; Number Of Usb Channels: 1; Data Bus Width: 32bits; Number Of I2C Channels: 3; Number Of Pwm Channels: 31; Frequency: 170MHz; Memory Type: FLASH; Number Of Timers/Counters: 14; Ram Size: 32KBytes; Max Junction Temp: +105°C; Memory Size: 128KBytes; Min Supply Voltage: 1.62V; Max Supply Voltage: 3.6V; Number Of Uart Channels: 4; Interface: I2C,SPI,UART,USART,CAN,USB,LIN,IrDA,I2S; Temperature Range Low: -40°C; Lead Free: Yes; Device Class L3: Microcontrollers; Number Of Cores: 1; Temperature Range High: +85°C; Height: 1.6mm; Digikey Description: MAINSTREAM ARM CORTEX-M4+ MCU 17; Device Class L1: Integrated Circuits (ICs); Package: LQFP48-5B; RoHS: TRUE; Number Of A/D Converters: 1; Core Architecture: Arm Cortex-M4; Device Class L2: Embedded Processors and Controllers; ComponentLink2Description: Datasheet; Temperature: -40°C to +85°C; Ambient Temperature Range High: +85°C; Ambient Temperature Range Low: -40°C; Octopart: https://octopart.com/stm32g431cbt6-stmicroelectronics-98835224; ComponentLink2URL: https://www.st.com/resource/en/datasheet/stm32g431cb.pdf; Automotive: No; Number Of Spi Channels: 3; Manufacturer Part Number: STM32G431CBT6; Category: IC
UART = CMP-02766-001388-1: CONN HEADER VERT 4POS 2.54MM; Number of Contacts: 4; Gender: Male; Connector Type: Male Pin; Max Voltage Rating (AC): 550V; Max Current Rating: 7.6A; Radiation Hardening: No; Lead Free: Lead Free; RoHS Compliant: Yes; Contact Material: Bronze; Number of Positions: 4; Housing Color: Black; Min Operating Temperature: -55°C; Mount: Through Hole; Number of Rows: 1; Orientation: Straight; Contact Mating Length: 0.23inch; Contact Type: Male Pin; REACH SVHC: No SVHC; Max Operating Temperature: 105°C; Color: Black; Pitch: 2.54mm; Length: 10.16mm; Series: TSW; Packaging: Bulk; Contact Plating: Tin; Package Quantity: 1; Termination: Solder; Housing Material: Polyester; Width: 2.54mm; Depth: 2.54mm

## Sheet MicroSD.SchDoc
size A; SheetNumber: 7; SheetTotal: 8
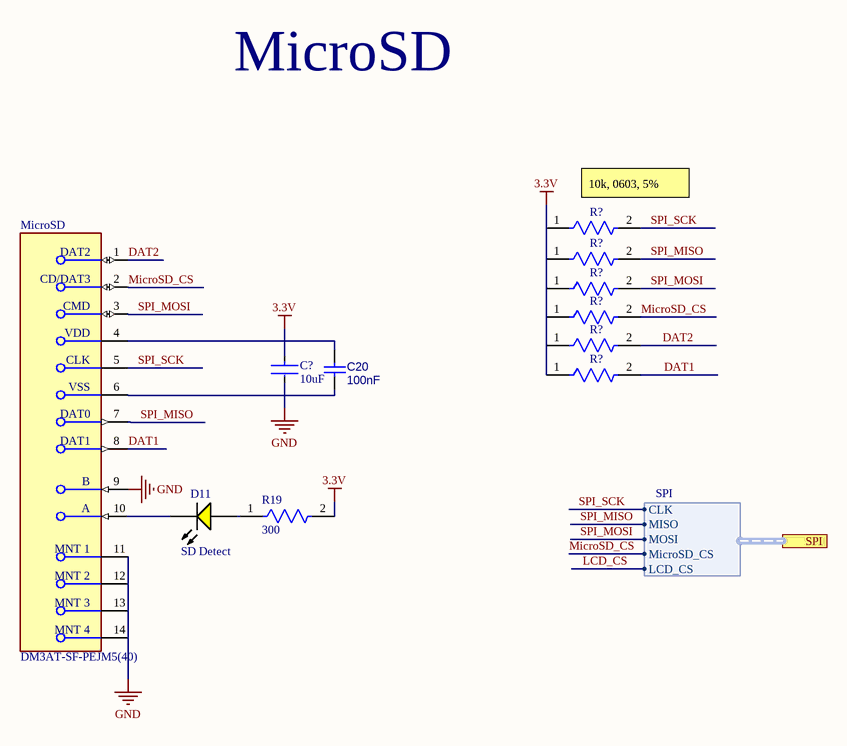
[diagram p4: MicroSD.SchDoc]

### Parts
(Parts that share a designator on the sheet are numbered #1, #2 ... from top to bottom, then left to right.)
C20  100nF  [CAPC2013X95X50LL10T25]
C?#7  10uF  [FP-GCM32E-0_3-IPC_B]
D11  SD Detect  [LTST-C170KSKT_V]
MicroSD  DM3AT-SF-PEJM5(40)  [FP-DM3AT-SF-PEJM5_40-MFG]
R19  300  [FP-CR0805-MFG]
R?#4  10k  [FP-AC0603-IPC_A]  (value not drawn)
R?#5  10k  [FP-AC0603-IPC_A]  (value not drawn)
R?#6  10k  [FP-AC0603-IPC_A]  (value not drawn)
R?#7  10k  [FP-AC0603-IPC_A]  (value not drawn)
R?#8  10k  [FP-AC0603-IPC_A]  (value not drawn)
R?#9  10k  [FP-AC0603-IPC_A]  (value not drawn)

### Ports
SPI (harness SPI)

### Harnesses
SPI: MISO, MOSI, CLK, MicroSD_CS, LCD_CS

### Nets
3.3V: C20.2 C?#7.2 MicroSD.4(VDD) R19.2 R?#4.1 R?#5.1 R?#6.1 R?#7.1 R?#8.1 R?#9.1
GND: C20.1 C?#7.1 MicroSD.6(VSS) MicroSD.9(B) MicroSD.11(MNT_1) MicroSD.12(MNT_2) MicroSD.13(MNT_3) MicroSD.14(MNT_4)
DAT1: MicroSD.8(DAT1) R?#9.2
DAT2: MicroSD.1(DAT2) R?#8.2
MicroSD_CS: MicroSD.2(CD/DAT3) R?#7.2 ; port SPI.MicroSD_CS
SPI_MISO: MicroSD.7(DAT0) R?#5.2 ; port SPI.MISO
SPI_MOSI: MicroSD.3(CMD) R?#6.2 ; port SPI.MOSI
SPI_SCK: MicroSD.5(CLK) R?#4.2
NetD11_1: D11.1(A) R19.1
NetD11_2: D11.2(K) MicroSD.10(A)

### Notes on the sheet
- MicroSD
- (near R?#4) 10k, 0603, 5%

### Library data of the parts
C20 = CMP-001-00018-6: as C1 on sheet Buck and LDO; Value: 100nF; Pins: 2; Max Operating Temperature: 125°C; Min Operating Temperature: -55°C; Mounting Technology: SM; Case/Package: 0805; RoHS Compliant: True
C?#7 = CMP-2000-06321-2: as C?#1 on sheet MCU; Thickness: 0.106inch; Min Operating Temperature: -55°C; Max Operating Temperature: 125°C; Ratings: AEC-Q200; Packaging: Tape and Reel; Package Quantity: 1; Width: 2.5mm; Mount: Surface Mount; Height: 2.5mm; Case Code (Imperial): 1210; Length: 3.2mm; Capacitance: 10uF; Tolerance: 10%; Lead Free: Lead Free; Dielectric: X7R; REACH SVHC: No SVHC; Case/Package: 1210; Voltage Rating: 25V; Depth: 2.5mm; Case Code (Metric): 3225; Termination: SMD/SMT; Voltage Rating (DC): 25V; Radiation Hardening: No
D11 = CMP-2000-06621-1: LTST-C170KSKT LED Yellow, 75 mW, 80 mA, -55 to 85 degC, 2-Pin SMD, RoHS, Tape and Reel; Manufacturer: Lite-On; Main Category: ChipLED; Product Depth (mm): 1.25mm; Dominant Wave Length: 587nm; Viewing Angle: 130deg; Luminous Intensity: 112mcd; Test Current (It): 20mA; Emitting Color: Amber; Chip Material: AlGaInP; Product Height (mm): 1.1mm; Forward Voltage: 2.4V; High Brightness: Yes; Forward Current: 30mA; Number of  Elements: 1; Power Dissipation: 75W; Type: Uni-Color; Shape Type: Rectangular; Peak Wavelength: 588nm; Reverse Voltage: 5V; Rad Hardened: No; Product Length (mm): 2mm; DELETED: Compliant; Package Description: 2-Pin Surface Mount Device, Body 2 x 1.25 mm; Mounting: SurfaceMount; Lum Intensity: 112mcd; Pin Count: 2; Mounting Technology: SurfaceMount; Package Reference: C170KSKT; Datasheet Version: Rev. H, 04/2014; Package Type: ChipLed; Packaging: TapeandReel; Manufacturer URL: http://www.us.liteon.com/; Datasheet URL: http://optoelectronics.liteon.com/upload/download/DS-22-99-0188/S_110_LTST-C170KSKT.pdf; Operating Temp Range: -55Cto85C; Lens Dimensions: 1.4x1.25x0.6mm; Operating Temperature Classification: Industrial
MicroSD = CMP-11597-000006-1: CONN MICRO SD R/A PUSH-PUSH SMD; Contact Resistance: 100mR; Insulation Resistance: 1GR; Gender: Receptacle; Max Voltage Rating (AC): 125V; Pitch: 1.1mm; Mating Cycles: 10000; Max Current Rating: 500mA; Connector Type: Connector; Number of Contacts: 8; Housing Material: Polymer; Flammability Rating: UL94 V-0; REACH SVHC: No SVHC; Lead Free: Lead Free; Package Quantity: 400; Length: 13.85mm; Number of Rows: 2; Series: DM3; Min Operating Temperature: -25°C; Voltage Rating (AC): 125V; Contact Material: Copper Alloy; Depth: 15.95mm; Contact Plating: Gold; Packaging: Tape and Reel; Width: 13.85mm; Orientation: Right Angle; Color: Black; Voltage Rating: 125V; Radiation Hardening: No; Termination: Solder; Current Rating: 500mA; Mount: Surface Mount; Max Operating Temperature: 85°C
R19 = CMP-07231-003646-1: as R13 on sheet Constant Current Sink; Contact Plating: Tin; Number of Terminations: 2; Termination: SMD/SMT; Case Code (Imperial): 0805; Mount: Surface Mount; Length: 2mm; Thickness: 508um; Package Quantity: 1; Case Code (Metric): 2012; Width: 1.25mm; Military Standard: Not; Max Operating Temperature: 155°C; Temperature Coefficient: 100ppm/°C; Min Operating Temperature: -55°C; Features: Moisture Resistant; Radiation Hardening: No; Composition: Thick Film; Height: 0.024inch; Power Rating: 125mW; Depth: 1.25mm; Tolerance: 1%; Packaging: Tape and Reel; Case/Package: 0805
R?#4-R?#9 = CMP-03412-040683-1: RES 10kΩ 5.00% 0.2W 0603

## Sheet Cell Monitoring.SchDoc
size A; SheetNumber: 8; SheetTotal: 8
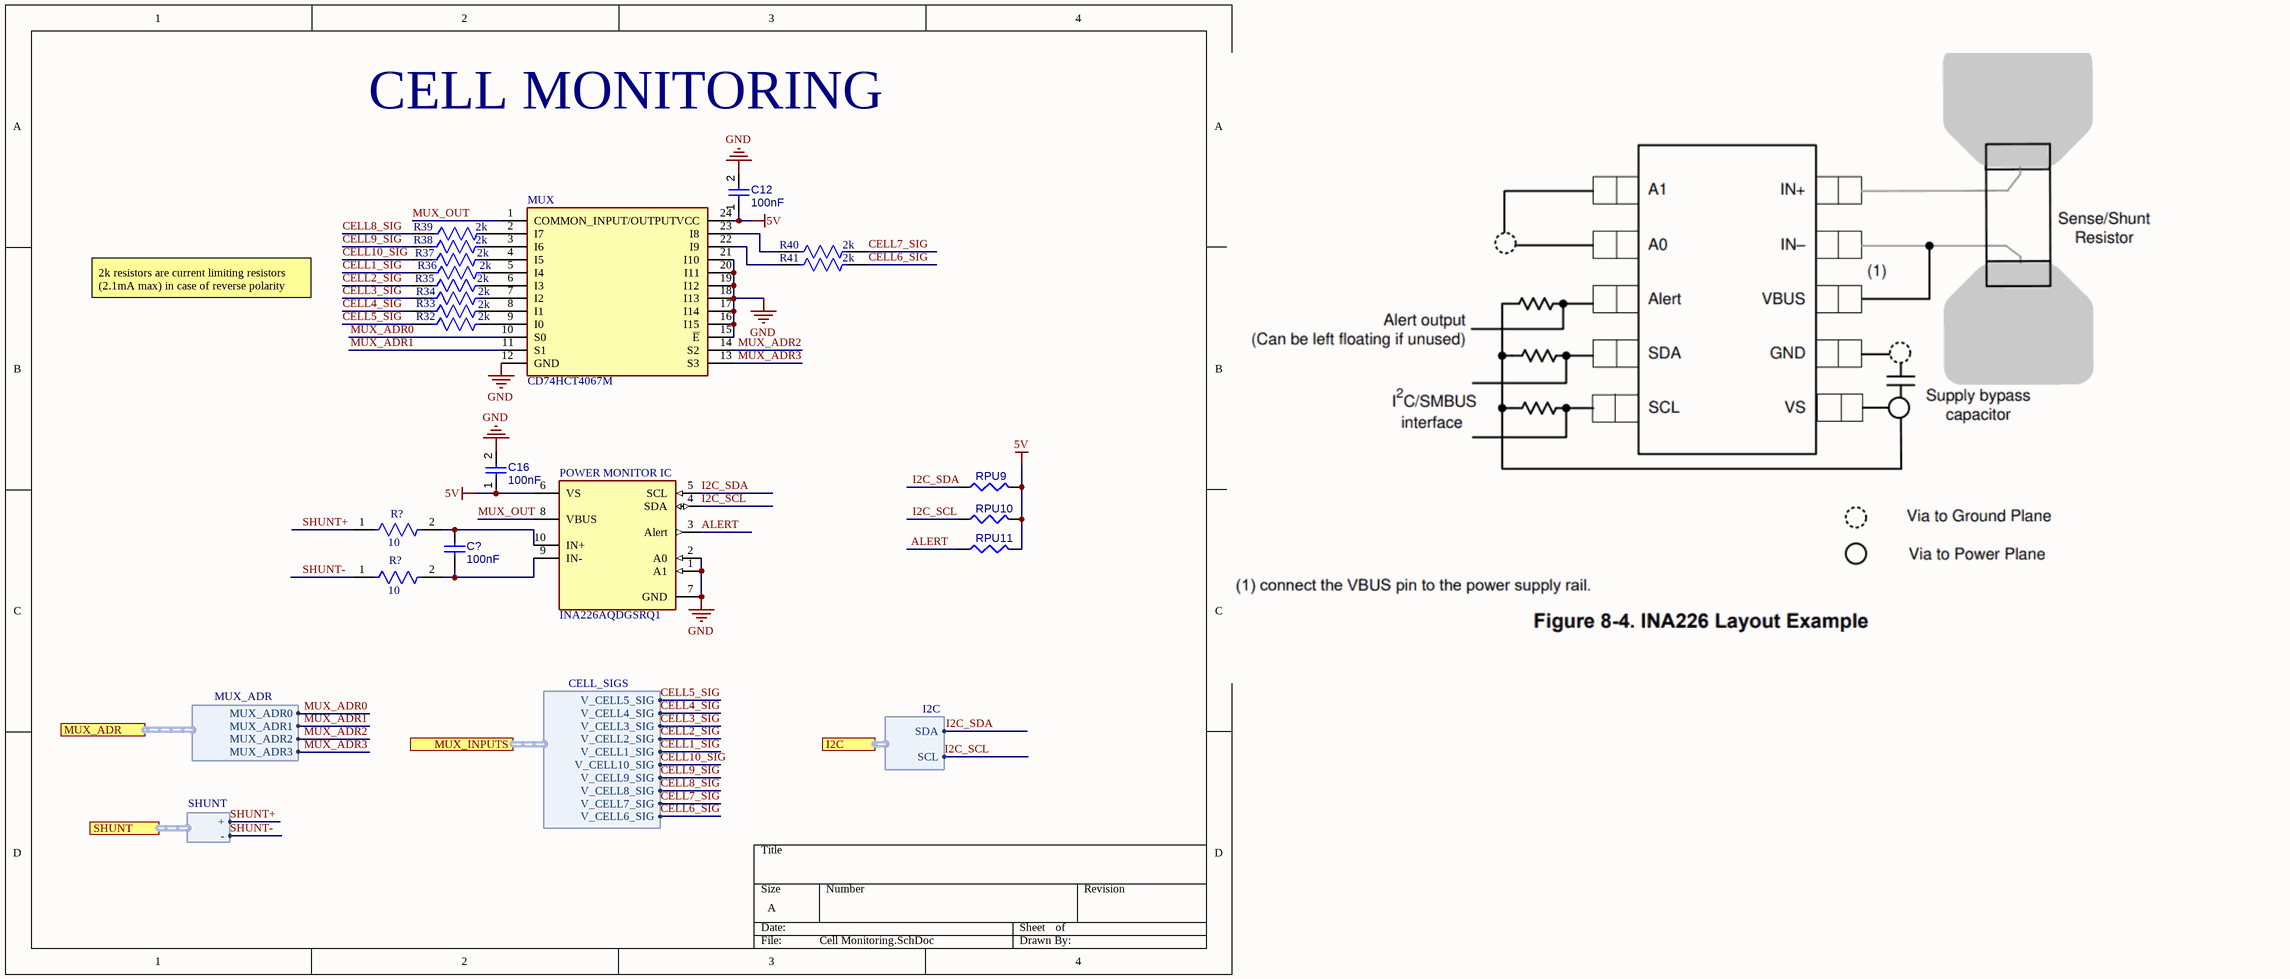
[diagram p5: Cell Monitoring.SchDoc]

### Parts
(Parts that share a designator on the sheet are numbered #1, #2 ... from top to bottom, then left to right.)
C12  100nF  [CAPC2013X95X50LL10T25]
C16  100nF  [CAPC2013X95X50LL10T25]
C?#8  100nF  [CAPC2013X95X50LL10T25]
MUX  CD74HCT4067M  [SOIC127P1030X265-24N]
POWER_MONITOR_IC  INA226AQDGSRQ1  [FP-DGS0010A-IPC_A]
R32  2k  [FP-TFCR0603-IPC_B]
R33  2k  [FP-TFCR0603-IPC_B]
R34  2k  [FP-TFCR0603-IPC_B]
R35  2k  [FP-TFCR0603-IPC_B]
R36  2k  [FP-TFCR0603-IPC_B]
R37  2k  [FP-TFCR0603-IPC_B]
R38  2k  [FP-TFCR0603-IPC_B]
R39  2k  [FP-TFCR0603-IPC_B]
R40  2k  [FP-TFCR0603-IPC_B]
R41  2k  [FP-TFCR0603-IPC_B]
R?#10  10  [FP-CR0805-IPC_B]
R?#11  10  [FP-CR0805-IPC_B]
RPU9  Resistor 4k7 +/-1% 0805 125 mW  [RESC2013X70X40ML20T20]  (value not drawn)
RPU10  Resistor 4k7 +/-1% 0805 125 mW  [RESC2013X70X40ML20T20]  (value not drawn)
RPU11  Resistor 4k7 +/-1% 0805 125 mW  [RESC2013X70X40ML20T20]  (value not drawn)

### Ports
I2C (harness I2C), MUX_ADR (harness MUX_ADR), MUX_INPUTS (harness CELL_SIGS), SHUNT (harness SHUNT)

### Harnesses
CELL_SIGS: V_CELL1_SIG, V_CELL2_SIG, V_CELL3_SIG, V_CELL4_SIG, V_CELL5_SIG, V_CELL6_SIG, V_CELL7_SIG, V_CELL8_SIG, V_CELL9_SIG, V_CELL10_SIG
MUX_ADR: MUX_ADR0, MUX_ADR1, MUX_ADR2, MUX_ADR3
I2C: SDA, SCL
SHUNT: +, -

### Nets
5V: C12.1 C16.1 MUX.24(VCC) POWER_MONITOR_IC.6(VS) RPU9.2 RPU10.2 RPU11.2
GND: C12.2 C16.2 MUX.12(GND) MUX.15(~{E}) MUX.16(I15) MUX.17(I14) MUX.18(I13) MUX.19(I12) MUX.20(I11) MUX.21(I10) POWER_MONITOR_IC.1(A1) POWER_MONITOR_IC.2(A0) POWER_MONITOR_IC.7(GND) R?#11.1 ; port SHUNT.-  [also labelled SHUNT-]
ALERT: POWER_MONITOR_IC.3(Alert) RPU11.1
CELL1_SIG: R36.1 ; port MUX_INPUTS.V_CELL1_SIG
CELL2_SIG: R35.1 ; port MUX_INPUTS.V_CELL2_SIG
CELL3_SIG: R34.1 ; port MUX_INPUTS.V_CELL3_SIG
CELL4_SIG: R33.1 ; port MUX_INPUTS.V_CELL4_SIG
CELL5_SIG: R32.1 ; port MUX_INPUTS.V_CELL5_SIG
CELL6_SIG: R41.2 ; port MUX_INPUTS.V_CELL6_SIG
CELL7_SIG: R40.2 ; port MUX_INPUTS.V_CELL7_SIG
CELL8_SIG: R39.1 ; port MUX_INPUTS.V_CELL8_SIG
CELL9_SIG: R38.1 ; port MUX_INPUTS.V_CELL9_SIG
CELL10_SIG: R37.1 ; port MUX_INPUTS.V_CELL10_SIG
I2C_SCL: POWER_MONITOR_IC.4(SDA) RPU10.1 ; port I2C.SCL
I2C_SDA: POWER_MONITOR_IC.5(SCL) RPU9.1 ; port I2C.SDA
MUX_ADR0: MUX.10(S0) ; port MUX_ADR.MUX_ADR0
MUX_ADR1: MUX.11(S1) ; port MUX_ADR.MUX_ADR1
MUX_ADR2: MUX.14(S2) ; port MUX_ADR.MUX_ADR2
MUX_ADR3: MUX.13(S3) ; port MUX_ADR.MUX_ADR3
MUX_OUT: MUX.1(COMMON_INPUT/OUTPUT) POWER_MONITOR_IC.8(VBUS)
SHUNT+: R?#10.1 ; port SHUNT.+
NetC?#8_1: C?#8.1 POWER_MONITOR_IC.9(IN-) R?#11.2
NetC?#8_2: C?#8.2 POWER_MONITOR_IC.10(IN+) R?#10.2
NetMUX_3: MUX.3(I6) R38.2
NetMUX_4: MUX.4(I5) R37.2
NetMUX_6: MUX.6(I3) R35.2
NetMUX_7: MUX.7(I2) R34.2
NetMUX_8: MUX.8(I1) R33.2
NetMUX_9: MUX.9(I0) R32.2
NetMUX_22: MUX.22(I9) R41.1
NetMUX_23: MUX.23(I8) R40.1

Not connected (* = marked no-connect by the designer): MUX 2(I7) 5(I4); R36 2; R39 2

### Notes on the sheet
- CELL MONITORING
- 2k resistors are current limiting resistors (2.1mA max) in case of reverse polarity

### Library data of the parts
C12 C16 C?#8 = CMP-001-00018-6: as C1 on sheet Buck and LDO; Value: 100nF; Pins: 2; Max Operating Temperature: 125°C; Min Operating Temperature: -55°C; Mounting Technology: SM; Case/Package: 0805; RoHS Compliant: True
MUX = CD74HCT4067M: Integrated Circuit; Manufacturer_Name: Texas Instruments; Datasheet Link: http://www.ti.com/lit/gpn/cd74hct4067; Height: 2.65mm; Manufacturer_Part_Number: CD74HCT4067M; Mouser Part Number: 595-CD74HCT4067M; Mouser Price/Stock: https://www.mouser.co.uk/ProductDetail/Texas-Instruments/CD74HCT4067M?qs=vul0MlC%2Fa1fex%2F7NLRWpgQ%3D%3D; Arrow Part Number: CD74HCT4067M; Arrow Price/Stock: https://www.arrow.com/en/products/cd74hct4067m/texas-instruments?utm_currency=USD&region=nac
POWER_MONITOR_IC = CMP-04895-000197-1: IC MONITOR PWR/CURR BIDIR 10MSOP; Max Supply Voltage: 5.5V; Output Current: 10mA; Min Supply Voltage: 2.7V; Accuracy: 0.02%; Min Operating Temperature: -40°C; RoHS Compliant: Yes; Lead Free: Lead Free; Case/Package: VSSOP; Max Operating Temperature: 125°C; Mount: Surface Mount; Number of Pins: 10; Packaging: Tape and Reel
R32-R41 = CMP-250906-173560-1: TFCR0603-10W-E-2001BT
R?#10 R?#11 = CMP-07231-004657-1: Thick Film Chip Resistors 0805 10Ω 0.125W 1% 100ppm/°C; Voltage Rating (DC): 150V; Resistance: 10R; Power Rating: 125mW; Tolerance: 1%; Min Operating Temperature: -55°C; Length: 2mm; Case Code (Metric): 2012; Temperature Coefficient: 100ppm/°C; Height: 0.5mm; Max Operating Temperature: 155°C; Case/Package: 0805; Width: 1.25mm; Composition: Thick Film; Contact Plating: Tin; Termination: SMD/SMT; Packaging: Tape and Reel; REACH SVHC: No SVHC; Number of Pins: 2; Package Quantity: 5000; Mount: Surface Mount; Military Standard: Not; Thickness: 508um; Case Code (Imperial): 0805; Depth: 1.25mm; Radiation Hardening: No; Voltage Rating: 150V
RPU9-RPU11 = CMP-009-00032-5: as RPU1 on sheet Sequantial Cell Switching; Tolerance: 1%; Mounting Technology: SM; RoHS Compliant: True; Min Operating Temperature: -55°C; Max Operating Temperature: 155°C; Case/Package: 0805; Pins: 2

## Nets that join several sheets
3.3V: Buck and LDO (3.3V_LDO.5 C21.2), MCU (14 pins), MicroSD (10 pins)
5V: Buck and LDO (11 pins), Constant Current Sink (5 pins), Sequantial Cell Switching (36 pins), Cell Monitoring (7 pins)
GND: Buck and LDO (27 pins), Constant Current Sink (9 pins), Sequantial Cell Switching (10 pins), MCU (13 pins), MicroSD (8 pins), Cell Monitoring (14 pins)
I2C_SCL: MCU (R5.1 U1.30), Cell Monitoring (POWER_MONITOR_IC.4 RPU10.1)
I2C_SDA: MCU (U1.31), Cell Monitoring (POWER_MONITOR_IC.5 RPU9.1)
MicroSD_CS: MCU (U1.16), MicroSD (MicroSD.2 R?#7.2)
MUX_ADR0: MCU (U1.8), Cell Monitoring (MUX.10)
MUX_ADR1: MCU (U1.9), Cell Monitoring (MUX.11)
MUX_ADR2: MCU (U1.10), Cell Monitoring (MUX.14)
MUX_ADR3: MCU (U1.11), Cell Monitoring (MUX.13)
NetMOSFET_CC_2: Constant Current Sink (MOSFET_CC.2), Sequantial Cell Switching (10 pins)
SHUNT+: Constant Current Sink (C13.2 MOSFET_CC.3 R15.2 SHUNT.2), Cell Monitoring (R?#10.1)
SPI_MISO: MCU (LCD_TFT.5 U1.41), MicroSD (MicroSD.7 R?#5.2)
SPI_MOSI: MCU (LCD_TFT.6 U1.42), MicroSD (MicroSD.3 R?#6.2)